# Altium project ADC.PrjPcb
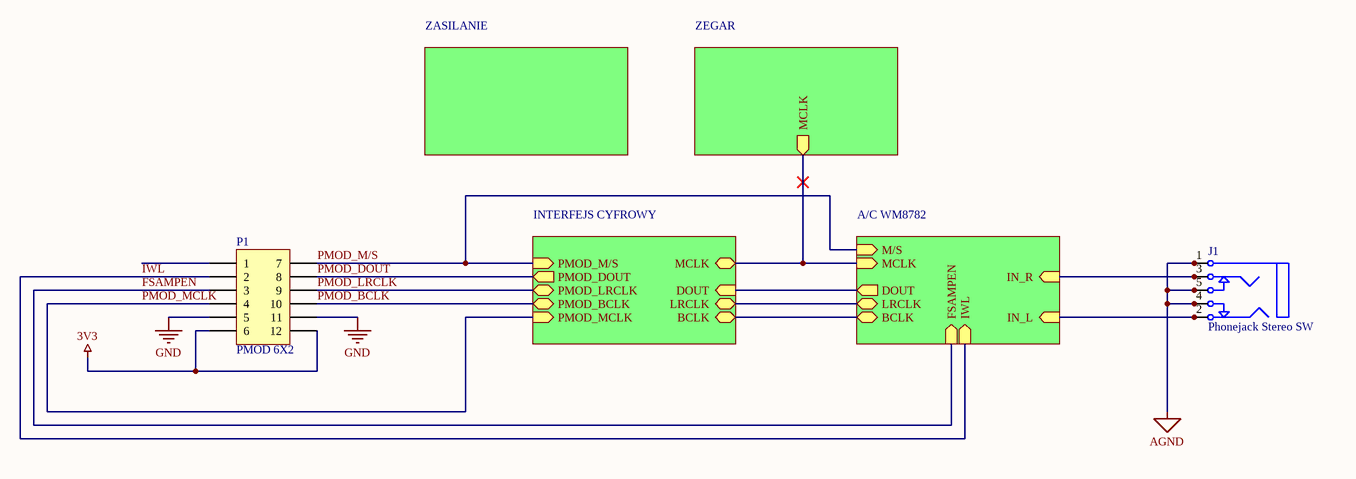
[diagram p0: AdcPmod.SchDoc]
5 sheets, 45 parts. Net scope: hierarchical (ports join the sheet entries above them; power ports are global).
Board files: AdcPmodWM8782GC.PcbDoc, AdcPmodWM8782.PcbDoc
Sheets:
  AdcPmod.SchDoc
    ZASILANIE = AdcPmodPsu.SchDoc
    INTERFEJS CYFROWY = AdcPmodDigital.SchDoc
    A/C WM8782 = AdcPmodWM8782.SchDoc
    ZEGAR = AdcPmodClock.SchDoc

## Sheet AdcPmod.SchDoc
size A4

### Parts
J1  Phonejack Stereo SW  [Phone Jack Mini Stereo SJ1 - 354X]
P1  PMOD 6X2  [HDR2X6_CEN]

### Sub-sheets
A/C WM8782 = AdcPmodWM8782.SchDoc: DOUT (out), BCLK, LRCLK (bidir), MCLK (in), IN_R (in), IN_L (in), FSAMPEN (in), IWL (in), M/S (in)
INTERFEJS CYFROWY = AdcPmodDigital.SchDoc: BCLK (bidir), LRCLK (bidir), MCLK (bidir), DOUT (in), PMOD_LRCLK (bidir), PMOD_M/S (in), PMOD_BCLK, PMOD_DOUT (out), PMOD_MCLK (in)
ZASILANIE = AdcPmodPsu.SchDoc: no entries
ZEGAR = AdcPmodClock.SchDoc: MCLK (out)

### Nets
3V3: P1.6 P1.12
AGND: J1.1 J1.1A J1.1B J1.4 J1.4A J1.4B J1.5 J1.5A J1.5B P1.5 P1.11  [also labelled GND]
BCLK: sheet INTERFEJS CYFROWY/BCLK, sheet A/C WM8782/BCLK
DOUT: sheet INTERFEJS CYFROWY/DOUT, sheet A/C WM8782/DOUT
FSAMPEN: P1.3 ; sheet A/C WM8782/FSAMPEN
IN_L: J1.2 J1.2A J1.2B ; sheet A/C WM8782/IN_L
IN_R: J1.3 J1.3A J1.3B ; sheet A/C WM8782/IN_R
IWL: P1.2 ; sheet A/C WM8782/IWL
LRCLK: sheet INTERFEJS CYFROWY/LRCLK, sheet A/C WM8782/LRCLK
MCLK: sheet INTERFEJS CYFROWY/MCLK, sheet A/C WM8782/MCLK, sheet ZEGAR/MCLK
PMOD_BCLK: P1.10 ; sheet INTERFEJS CYFROWY/PMOD_BCLK
PMOD_DOUT: P1.8 ; sheet INTERFEJS CYFROWY/PMOD_DOUT
PMOD_LRCLK: P1.9 ; sheet INTERFEJS CYFROWY/PMOD_LRCLK
PMOD_M/S: P1.7 ; sheet INTERFEJS CYFROWY/PMOD_M/S, sheet A/C WM8782/M/S
PMOD_MCLK: P1.4 ; sheet INTERFEJS CYFROWY/PMOD_MCLK

Not connected (* = marked no-connect by the designer): P1 1

### Library data of the parts
J1 = Phonejack Stereo SW: 3-Conductor Jack with 2 break contacts (normals) and 2 auxiliary make contacts; pin to pad: 1A>1 1B>1 2A>2 2B>2 3A>3 3B>3 4A>4 4B>4 5A>5 5B>5; Manufacturer: CUI; Mfr. Part No.: SJ1-3545N; Suplier Part No.: 490-SJ1-3545N; Supplier: Mouser
P1 = Header 6X2A: Header, 6-Pin, Dual row; Manufacturer: Wurth Electronics; Mfr. Part No.: 61301221021; Suplier Part No.: 710-61301221021; Supplier: Mouser

## Sheet AdcPmodPsu.SchDoc
size A4
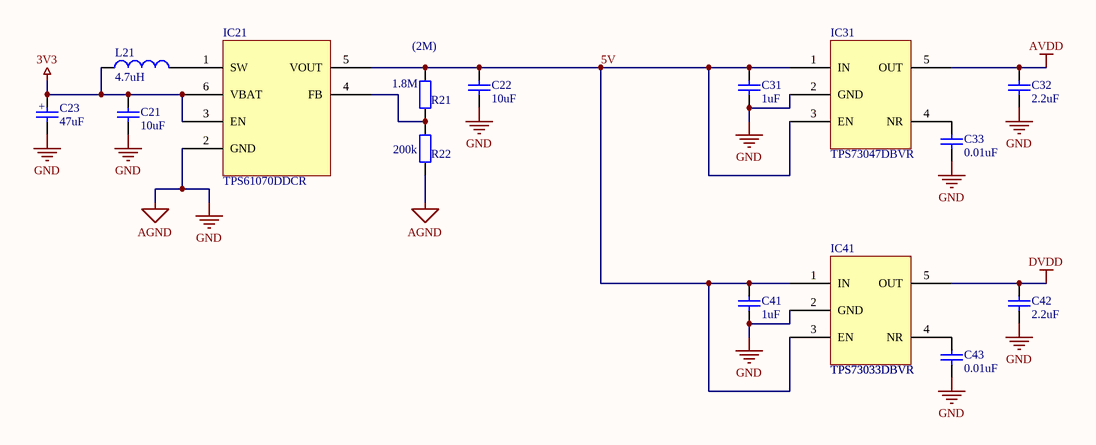
[diagram p1: AdcPmodPsu.SchDoc]

### Parts
C21  10uF  [CAP0805]
C22  10uF  [CAP0805]
C23  47uF  [CAP_POL1206]
C31  1uF  [CAP0805]
C32  2.2uF  [CAP0805]
C33  0.01uF  [CAP0805]
C41  1uF  [CAP0805]
C42  2.2uF  [CAP0805]
C43  0.01uF  [CAP0805]
IC21  TPS61070DDCR  [SOT23 (DDC TI)]
IC31  TPS73047DBVR  [SOT23 (5) (DBVTI)]
IC41  TPS73033DBVR  [SOT23 (5) (DBVTI)]
L21  4.7uH  [IND1206 (HS)]
R21  1.8M  [RES0805]
R22  200k  [RES0805]

### Nets
3V3: C21.2 C23.1 IC21.3(EN) IC21.6(VBAT) L21.1
AGND: C21.1 C22.1 C23.2 C31.1 C32.1 C33.1 C41.1 C42.1 C43.1 IC21.2(GND) IC31.2(GND) IC41.2(GND) R22.1  [also labelled GND]
AVDD: C32.2 IC31.5(OUT)
DVDD: C42.2 IC41.5(OUT)
5V: C22.2 C31.2 C41.2 IC21.5(VOUT) IC31.1(IN) IC31.3(EN) IC41.1(IN) IC41.3(EN) R21.2
NetC33_2: C33.2 IC31.4(NR)
NetC43_2: C43.2 IC41.4(NR)
NetIC21_1: IC21.1(SW) L21.2
NetIC21_4: IC21.4(FB) R21.1 R22.2

### Notes on the sheet
- (near R21) (2M)
- (in symbol CAP_POL) +

### Library data of the parts
C21 C22 = CAP: Ceramic X7R; Manufacturer: Murata Electronics; Mfr. Part No.: GRM21BR71A106KE51L; Suplier Part No.: 81-GRM21BR71A106KE51; Value: 10uF; Supplier: Mouser
C23 = CAP_POL: Capacitor Tantalum - Polymer; Manufacturer: Vishay / Polytech; Mfr. Part No.: T58A0476M010C0100; Suplier Part No.: 74-T58A0476M010C0100; Value: 47uF; Supplier: Mouser
C31 C41 = CAP: Ceramic X7R; Manufacturer: Murata Electronics; Mfr. Part No.: GRM21BR71A105KA01L; Suplier Part No.: 81-GRM40X105K10L; Value: 1uF; Supplier: Mouser
C32 C42 = CAP: Ceramic X7R; Manufacturer: Murata Electronics; Mfr. Part No.: GRM21BR71A225KA01L; Suplier Part No.: 81-GRM21BR71A225KA01; Value: 2.2uF; Supplier: Mouser
C33 C43 = CAP: Ceramic X7R; Manufacturer: Murata Electronics; Mfr. Part No.: GRM216R71E103KA01D; Suplier Part No.: 81-GRM216R71E103KA01; Value: 0.01uF; Supplier: Mouser
IC21 = TPS6107x: Adjustable, 600-mA Switch, 90% Efficient PFM/PWM Boost Converter; Manufacturer: Texas Instruments; Suplier Part No.: 595-TPS61070DDCR; Mfr. Part No.: TPS61070DDCR; Supplier: Mouser
IC31 = TPS730x: Manufacturer: Texas Instruments; Suplier Part No.: 595-TPS73047DBVR; Mfr. Part No.: TPS73047DBVR; Supplier: Mouser
IC41 = TPS730x: Manufacturer: Texas Instruments; Suplier Part No.: 595-TPS73033DBVT; Mfr. Part No.: TPS73033DBVR; Supplier: Mouser
L21 = IND: Inductor; Manufacturer: Murata Electronics; Mfr. Part No.: LQM31PN4R7M00L; Suplier Part No.: 81-LQM31PN4R7M00L; Value: 4.7uH; Supplier: Mouser
R21 = RES: Thick Film; Manufacturer: Vishay; Mfr. Part No.: CRCW12061M80FKEA; Suplier Part No.: 71-CRCW12061M80FKEA; Value: 1.8M; Supplier: Mouser
R22 = RES: Thin Film; Manufacturer: Vishay; Mfr. Part No.: TNPW1206200KBEEA; Suplier Part No.: 71-TNPW1206200KBEEA; Value: 200k; Supplier: Mouser

## Sheet AdcPmodDigital.SchDoc
size A4
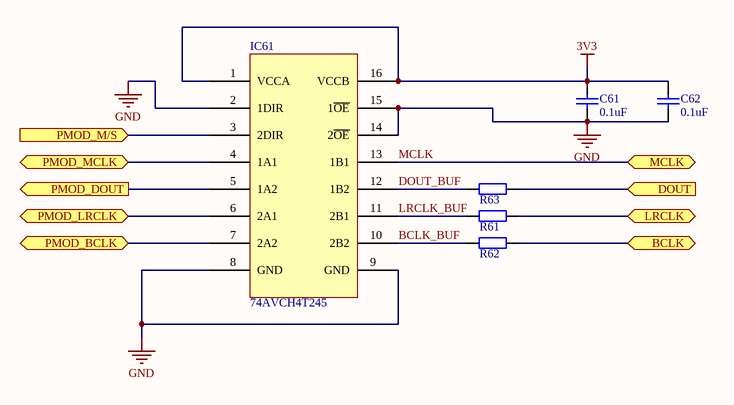
[diagram p2: AdcPmodDigital.SchDoc]

### Parts
C61  0.1uF  [CAP0805]
C62  0.1uF  [CAP0805]
IC61  74AVCH4T245  [TSSOP16]
R61  RES  [RES0805]  (value not drawn)
R62  RES  [RES0805]  (value not drawn)
R63  RES  [RES0805]  (value not drawn)

### Ports
BCLK (bidir), DOUT (in), LRCLK (bidir), MCLK (bidir), PMOD_BCLK, PMOD_DOUT (out), PMOD_LRCLK (bidir), PMOD_M/S (in), PMOD_MCLK (bidir)

### Nets
3V3: C61.2 C62.2 IC61.1(VCCA) IC61.16(VCCB)
GND: C61.1 C62.1 IC61.2(1DIR) IC61.8(GND) IC61.9(GND) IC61.14(2~{OE}) IC61.15(1~{OE})  [project net AGND]
BCLK: R62.2 ; port BCLK
BCLK_BUF: IC61.10(2B2) R62.1
DOUT: R63.2 ; port DOUT
DOUT_BUF: IC61.12(1B2) R63.1
LRCLK: R61.2 ; port LRCLK
LRCLK_BUF: IC61.11(2B1) R61.1
MCLK: IC61.13(1B1) ; port MCLK
PMOD_BCLK: IC61.7(2A2) ; port PMOD_BCLK
PMOD_DOUT: IC61.5(1A2) ; port PMOD_DOUT
PMOD_LRCLK: IC61.6(2A1) ; port PMOD_LRCLK
PMOD_M/S: IC61.3(2DIR) ; port PMOD_M/S
PMOD_MCLK: IC61.4(1A1) ; port PMOD_MCLK

### Library data of the parts
C61 C62 = CAP: Ceramic X7R; Manufacturer: AVX; Mfr. Part No.: 08055C104KAT2A; Suplier Part No.: 581-08055C104K; Value: 0.1uF; Supplier: Mouser
IC61 = 74AVCH4T245: Translation - Voltage Levels 4-Bit Dual-Supply Bus Xcvr; Manufacturer: Texas Instruments; Mfr. Part No.: SN74AVCH4T245PWR; Suplier Part No.: 595-SN74AVCH4T245PWR; Supplier: Mouser
R61-R63 = RES: Resistor

## Sheet AdcPmodWM8782.SchDoc
size A4
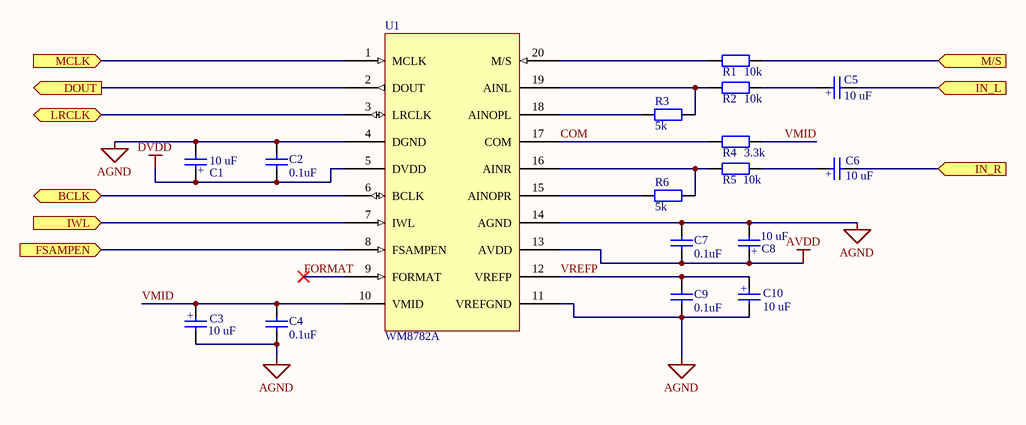
[diagram p3: AdcPmodWM8782.SchDoc]

### Parts
C1  10 uF  [CAP_POL1206]
C2  0.1uF  [CAP0805]
C3  10 uF  [CAP_POL1206]
C4  0.1uF  [CAP0805]
C5  10 uF  [CAP EL SMD Dia. 5mm]
C6  10 uF  [CAP EL SMD Dia. 5mm]
C7  0.1uF  [CAP0805]
C8  10 uF  [CAP_POL1206]
C9  0.1uF  [CAP0805]
C10  10 uF  [CAP_POL1206]
R1  10k  [RES0805]
R2  10k  [RES0805]
R3  5k  [RES0805]
R4  3.3k  [RES0805]
R5  10k  [RES0805]
R6  5k  [RES0805]
U1  WM8782A  [SSOP16 5.3mm]

### Ports
BCLK, DOUT (out), FSAMPEN (in), IN_L (in), IN_R (in), IWL (in), LRCLK (bidir), M/S (in), MCLK (in)

### Nets
AGND: C1.2 C2.2 C3.2 C4.1 C7.2 C8.2 C9.1 C10.2 U1.4(DGND) U1.11(VREFGND) U1.14(AGND)
AVDD: C7.1 C8.1 U1.13(AVDD)
DVDD: C1.1 C2.1 U1.5(DVDD)
BCLK: U1.6(BCLK) ; port BCLK
COM: R4.1 U1.17(COM)
DOUT: U1.2(DOUT) ; port DOUT
FORMAT: U1.9(FORMAT)
FSAMPEN: U1.8(FSAMPEN) ; port FSAMPEN
IN_L: C5.2 ; port IN_L
IN_R: C6.2 ; port IN_R
IWL: U1.7(IWL) ; port IWL
LRCLK: U1.3(LRCLK) ; port LRCLK
MCLK: U1.1(MCLK) ; port MCLK
PMOD_M/S: R1.2 ; port M/S
VMID: C3.1 C4.2 R4.2 U1.10(VMID)
VREFP: C9.2 C10.1 U1.12(VREFP)
NetC5_1: C5.1 R2.1
NetC6_1: C6.1 R5.2
NetR1_1: R1.1 U1.20(M/S)
NetR2_2: R2.2 R3.2 U1.19(AINL)
NetR3_1: R3.1 U1.18(AINOPL)
NetR5_1: R5.1 R6.2 U1.16(AINR)
NetR6_1: R6.1 U1.15(AINOPR)

### Notes on the sheet
- (in symbol CAP_POL) +

### Library data of the parts
C1 C3 C8 C10 = CAP_POL: Capacitor Tantalum - Polymer; Manufacturer: Vishay / Polytech; Mfr. Part No.: T55A106M010C0200; Suplier Part No.: 74-T55A106M010C0200; Voltage Rating: 10 VDC; Value: 10 uF; Supplier: Mouser
C2 C4 C7 C9 = CAP: as C61 on sheet AdcPmodDigital; Value: 0.1uF; Supplier: Mouser
C5 C6 = CAP_POL: Electrolytic; Manufacturer: United Chemi-Con; Mfr. Part No.: EMZJ250ADA220ME61G; Suplier Part No.: 661-EMZJ250A220ME61G; Value: 10 uF; Supplier: Mouser
R1 R2 R5 = RES: Thin Film; Manufacturer: Vishay; Mfr. Part No.: TNPW080510K0FEEA; Suplier Part No.: 71-TNPW080510K0FEEA; Value: 10k; Supplier: Mouser
R3 R6 = RES: Thin Film; Manufacturer: Vishay; Mfr. Part No.: TNPW12065K00BEEN; Suplier Part No.: 71-TNPW12065K00BEEN; Value: 5k; Supplier: Mouser
R4 = RES: Resistor; Value: 3.3k
U1 = WM8782: 24-Bit, 192 kHz Stereo ADC; Manufacturer: Cirrus Logic; Mfr. Part No.: WM8782SEDS/V; Suplier Part No.: 238-WM8782SEDS/V; Supplier: Mouser

## Sheet AdcPmodClock.SchDoc
size A4
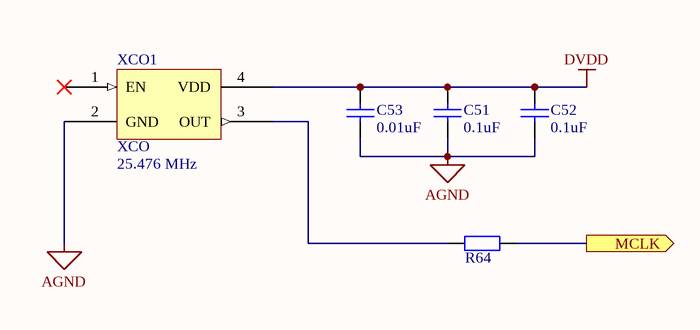
[diagram p4: AdcPmodClock.SchDoc]

### Parts
C51  0.1uF  [CAP0805]
C52  0.1uF  [CAP0805]
C53  0.01uF  [CAP0805]
R64  RES  [RES0805]  (value not drawn)
XCO1  XCO  Frequency: 25.476 MHz  [XCO 5x3.2mm (HS)]

### Ports
MCLK (out)

### Nets
AGND: C51.1 C52.1 C53.2 XCO1.2(GND)
DVDD: C51.2 C52.2 C53.1 XCO1.4(VDD)
MCLK: R64.2 ; port MCLK
NetR64_1: R64.1 XCO1.3(OUT)

Not connected (* = marked no-connect by the designer): XCO1 1(EN)*

### Library data of the parts
C51 C52 = CAP: as C61 on sheet AdcPmodDigital; Value: 0.1uF; Supplier: Mouser
C53 = CAP: as C33 on sheet AdcPmodPsu; Value: 0.01uF; Supplier: Mouser
R64 = RES: Resistor
XCO1 = XCO: Standard Clock Oscillator; Manufacturer: ABRACON; Mfr. Part No.: ASFL1-24.576MHZ-EC-T; Suplier Part No.: 815-ASFL1-24.5-EC-T; Supplier: Mouser

## Nets that join several sheets
3V3: AdcPmod (P1.6 P1.12), AdcPmodPsu (5 pins), AdcPmodDigital (C61.2 C62.2 IC61.1 IC61.16)
AGND: AdcPmod (11 pins), AdcPmodPsu (13 pins), AdcPmodDigital (7 pins), AdcPmodWM8782 (11 pins), AdcPmodClock (C51.1 C52.1 C53.2 XCO1.2)
AVDD: AdcPmodPsu (C32.2 IC31.5), AdcPmodWM8782 (C7.1 C8.1 U1.13)
DVDD: AdcPmodPsu (C42.2 IC41.5), AdcPmodWM8782 (C1.1 C2.1 U1.5), AdcPmodClock (C51.2 C52.2 C53.1 XCO1.4)
BCLK: AdcPmodDigital (R62.2), AdcPmodWM8782 (U1.6)
DOUT: AdcPmodDigital (R63.2), AdcPmodWM8782 (U1.2)
FSAMPEN: AdcPmod (P1.3), AdcPmodWM8782 (U1.8)
IN_L: AdcPmod (J1.2 J1.2A J1.2B), AdcPmodWM8782 (C5.2)
IN_R: AdcPmod (J1.3 J1.3A J1.3B), AdcPmodWM8782 (C6.2)
IWL: AdcPmod (P1.2), AdcPmodWM8782 (U1.7)
LRCLK: AdcPmodDigital (R61.2), AdcPmodWM8782 (U1.3)
MCLK: AdcPmodDigital (IC61.13), AdcPmodWM8782 (U1.1), AdcPmodClock (R64.2)
PMOD_BCLK: AdcPmod (P1.10), AdcPmodDigital (IC61.7)
PMOD_DOUT: AdcPmod (P1.8), AdcPmodDigital (IC61.5)
PMOD_LRCLK: AdcPmod (P1.9), AdcPmodDigital (IC61.6)
PMOD_M/S: AdcPmod (P1.7), AdcPmodDigital (IC61.3), AdcPmodWM8782 (R1.2)
PMOD_MCLK: AdcPmod (P1.4), AdcPmodDigital (IC61.4)